# EAGLE design touch-sensor (EAGLE 6.4)
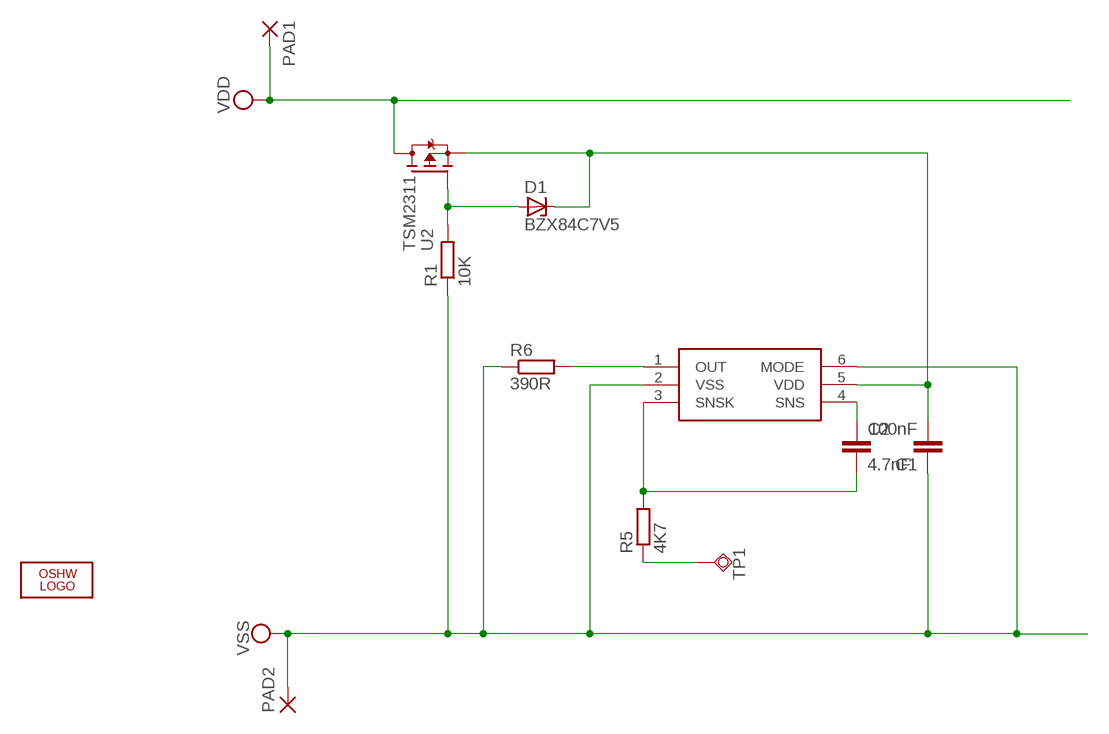
[diagram p0: schematic, sheet 1]

## Parts
C1  100nF  C-EUC0603  [C0603]
C2  4.7nF  C-EUC0603  [C0603]
D1  BZX84C7V5  BZX84C  [SOT23]
LOGO1  OSHW_LOGO_10MILX0200-NT  [OSHW_10X200_NOTEXT]
PAD1  3,81/1,3  [3,81/1,3]
PAD2  3,81/1,3  [3,81/1,3]
R1  10K  R-EU_R0603  [R0603]
R5  4K7  R-EU_R0603  [R0603]
R6  390R  R-EU_R0603  [R0603]
TP1  TPSQTP20SQ  [TP20SQ]
U1  AT42QT1011  [SOT23-6]
U2  TSM2311  [SOT23]

## Nets
N$1: C1.2 D1.3(C) U1.5(VDD) U2.2(S)
N$2: D1.1(A) R1.2 U2.1(G)
N$4: C2.1 U1.4(SNS)
N$5: C2.2 R5.2 U1.3(SNSK)
N$6: R6.2 U1.1(OUT)
N$10: R5.1 TP1.TP
VDD: PAD1.1(P) U2.3(D)
VSS: C1.1 PAD2.1(P) R1.1 R6.1 U1.2(VSS) U1.6(MODE)

## Library data of the parts
C1 C2 = resistor:C-EU: CAPACITOR, European symbol
D1 = __SR:BZX84C: Z DIODE
LOGO1 = ohw-logo:OSHW_LOGO_10MIL
PAD1 PAD2 = wirepad:3,81/1,3: THROUGH-HOLE PAD
R1 R5 R6 = resistor:R-EU_: RESISTOR, European symbol
TP1 = testpad:TPSQ: Test pad
U1 = __SR:AT42QT1011
U2 = __SR:TSM2311

## Board
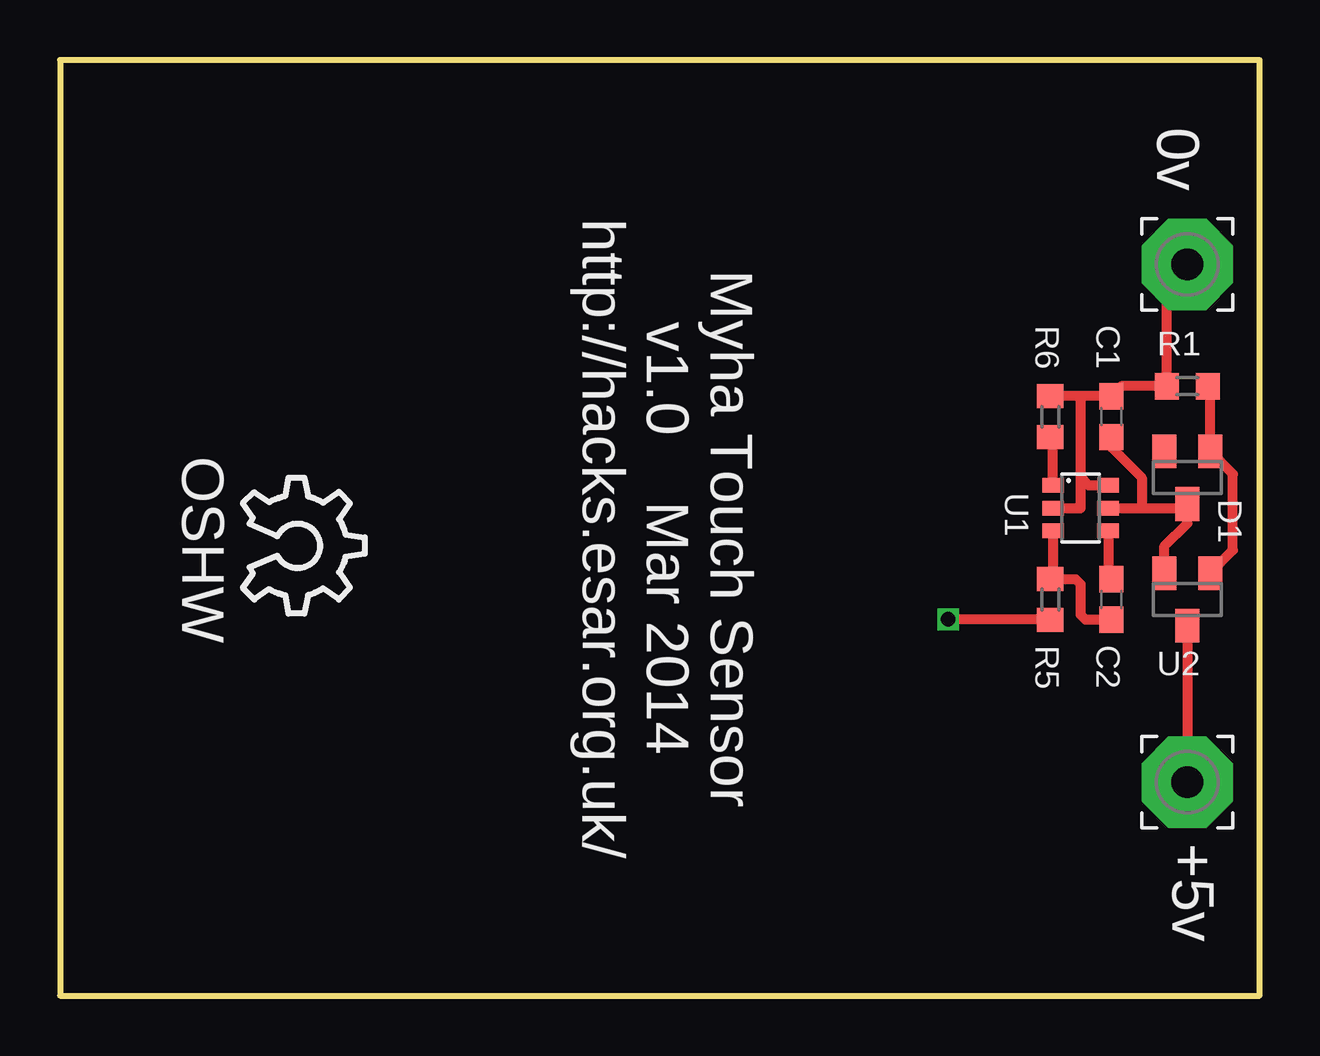
[diagram p1: board, top side]
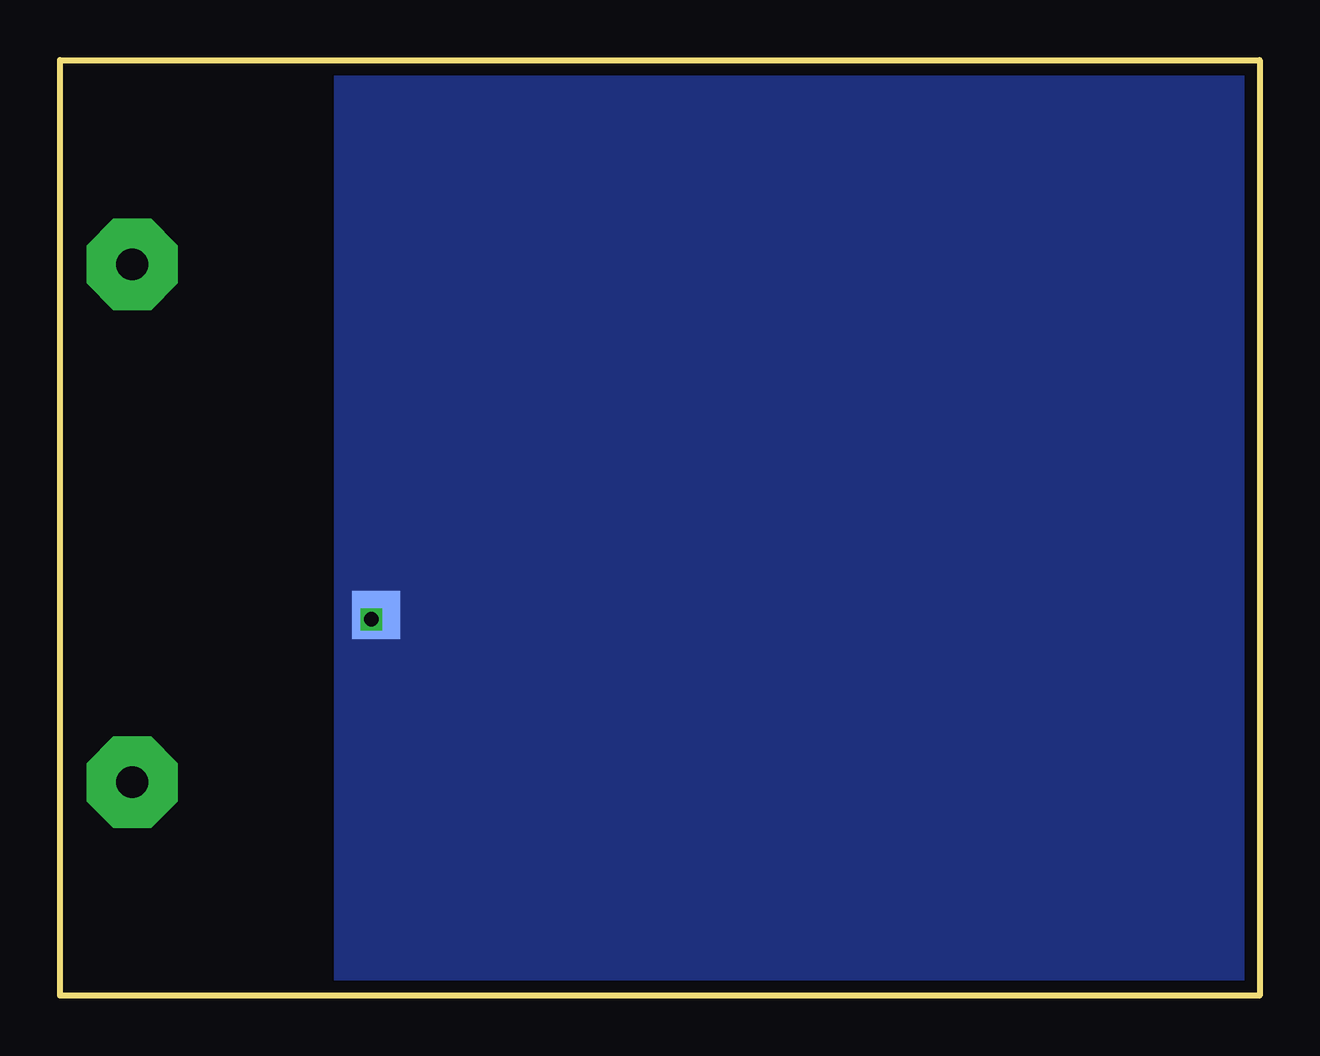
[diagram p2: board, bottom side, seen from below]

Size 50 x 39 mm. Coordinates in mm from the lower left corner, seen from the top.
Outline: 0,0 50,0 50,39 0,39 0,0
Copper layers (1*16): Top 0.035mm / dielectric 1.5mm / Bottom 0.035mm
Design rules "EagleRules *": minimum track width 7mil, minimum drill 12mil, track to track 7mil, track to pad 7mil, pad to pad 7mil, via to via 7mil, smd to smd 0mil, copper to edge 20mil, drill to drill 10mil, minimum pad ring 10mil, minimum via ring 6mil, stop-mask expansion 2mil, vias tented up to drill 25mil, thermal gap 10mil

### Footprints (pad centres in the part's own frame; a part is rotated, then mirrored left to right if it is on the bottom)
C0603 = smd 1.1 x 1: 1 -0.85,0; 2 0.85,0
SOT23 = smd 1 x 1.4: 1 -0.95,-1.1; 2 0.95,-1.1; 3 0,1.1
3,81/1,3 = drill 1.321 pad 3.81 octagon: 1 0,0
R0603 = smd 1 x 1.1: 1 -0.85,0; 2 0.85,0
TP20SQ = smd 2 x 2: TP 0,0
SOT23-6 = smd 0.6 x 0.9: 1 -0.95,-1.15; 2 0,-1.15; 3 0.95,-1.15; 4 0.95,1.15; 5 0,1.15; 6 -0.95,1.15

### Placement (x,y rotation side)
C1  43.81,24.13 270 top
C2  43.81,16.51 270 top
D1  46.99,21.59 180 top
LOGO1  7.62,21.59 270 top
PAD1  46.99,8.89 270 top
PAD2  46.99,30.48 270 top
R1  46.99,25.4 0 top
R5  41.27,16.51 90 top
R6  41.27,24.13 270 top
TP1  36.83,15.88 270 bottom
U1  42.55,20.32 270 top
U2  46.99,16.51 180 top

### Tracks (layer width: path | path; a pad name or v marks a point on that pad's centre or on a via)
N$1
  Top 0.406: C1.2 43.81,22.86 45.09,21.59 45.09,20.32 | U1.5 45.09,20.32 | 45.09,20.32 46.82,20.32 D1.3 46.99,19.68 46.04,18.73 U2.2
N$2
  Top 0.406: U2.1 48.9,18.57 48.9,21.73 D1.1 47.94,25.3 R1.2
N$4
  Top 0.406: U1.4 43.7,17.48 C2.1
N$5
  Top 0.406: C2.2 42.76,15.66 42.55,15.88 42.55,17.14 42.33,17.36 R5.2 41.4,17.48 U1.3
N$6
  Top 0.406: U1.1 41.4,23.16 R6.2
N$10  (via drill 0.6)
  Top 0.406: R5.1 41.26,15.68 v37.02,15.68
  Bottom 0.406: v37.02,15.68 TP1.TP
  pour Bottom (no thermals): 0,0 38.45,0 38.45,39 0,39
VDD
  Top 0.406: U2.3 PAD1.1
VSS
  Top 0.406: PAD2.1 46.14,29.63 R1.1 44.23,25.4 C1.1 42.55,24.98 | U1.6 42.87,21.27 42.55,21.59 | 42.55,21.59 42.55,24.98 | 42.55,24.98 R6.1 | U1.2 42.55,20.32 42.55,21.59

### Text on the board
tNames: 0v | OSHW | Myha Touch Sensor / v1.0 Mar 2014 / http://hacks.esar.org.uk/ | +5v